# EAGLE schematic final (EAGLE 7.4.0)
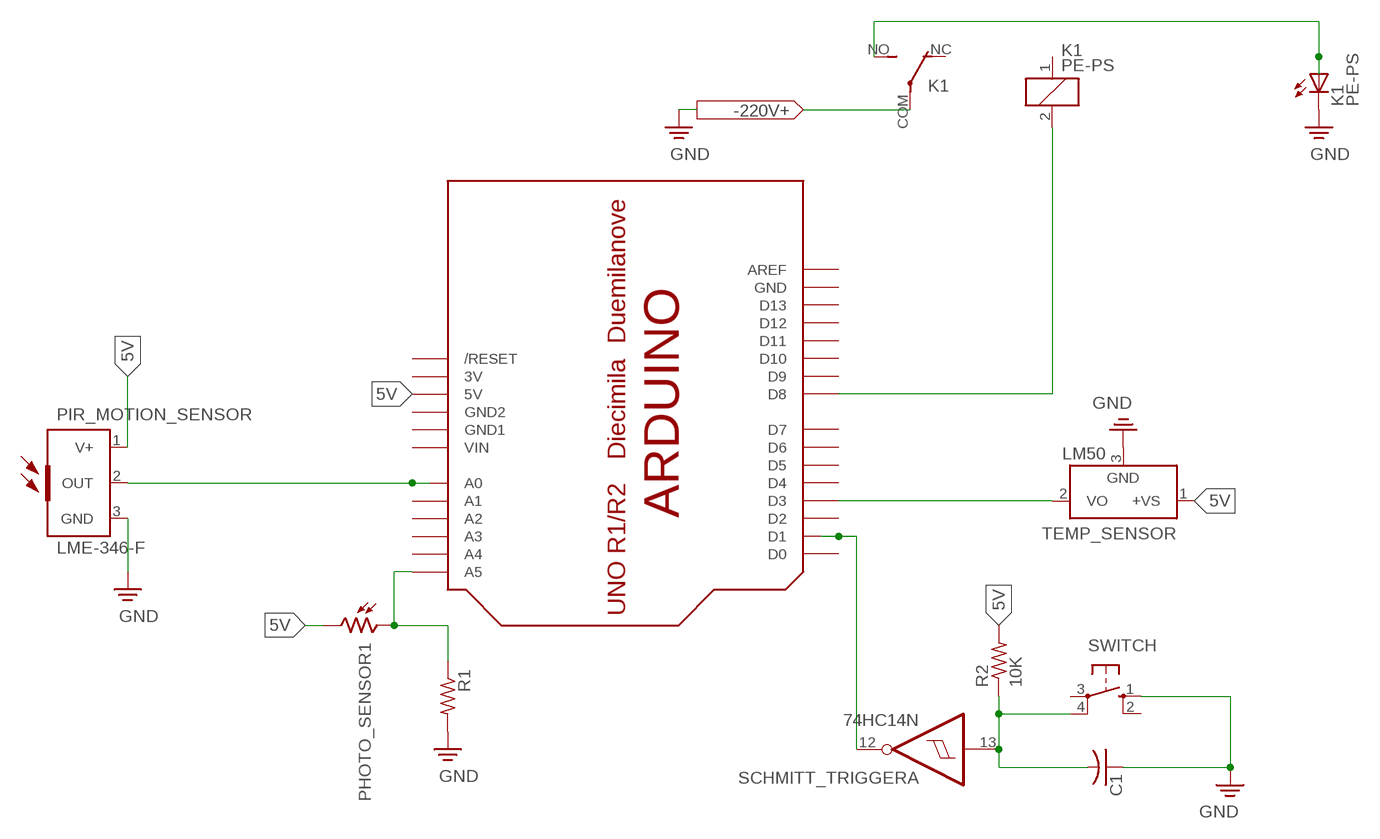
[diagram p0: schematic, sheet 1]

## Parts
C1  C-US025-024X044  [C025-024X044]
K1  PE-PS  [PE-SOCKET]
PHOTO_SENSOR1  PHOTOCELLD11  [D11XX_H]
PIR_MOTION_SENSOR  LME-346-F  [TO39]
R1  R-US_0207/7  [0207/7]
R2  10K  R-US_0207/7  [0207/7]
SCHMITT_TRIGGER  74HC14N  [DIL14]
SWITCH  40-XX  [B3F-40XX]
TEMP_SENSOR  LM50  [SOT23]
U$1  ARDUINOUNO  [ARDUINO]

## Nets
5V: PIR_MOTION_SENSOR.1(V+)
N$1: R2.1 SCHMITT_TRIGGER.13(A:I) SWITCH.4(P1)
N$2: PHOTO_SENSOR1.2
N$3: SCHMITT_TRIGGER.12(A:O) U$1.D1
N$4: PHOTO_SENSOR1.1 R1.1 U$1.A5
N$5: PIR_MOTION_SENSOR.2(OUT) U$1.A0
N$6: TEMP_SENSOR.2(VO) U$1.D3
N$8: K1.+LED(-LED:A) K1.NO(2:S)
N$9: K1.2 U$1.D8
PE: C1.1 K1.-LED(-LED:C) PIR_MOTION_SENSOR.3(GND) R1.2 SWITCH.1(S) TEMP_SENSOR.3(GND) ; supply symbol labelled GND
Unconnected: C1.2 K1.1 K1.COM(2:P) K1.NC(2:O) R2.2 SCHMITT_TRIGGER.1(D:I) SCHMITT_TRIGGER.2(D:O) SCHMITT_TRIGGER.3(E:I) SCHMITT_TRIGGER.4(E:O) SCHMITT_TRIGGER.5(F:I) SCHMITT_TRIGGER.6(F:O) SCHMITT_TRIGGER.8(C:O) SCHMITT_TRIGGER.9(C:I) SCHMITT_TRIGGER.10(B:O) SCHMITT_TRIGGER.11(B:I) SWITCH.2(S1) SWITCH.3(P) TEMP_SENSOR.1(+VS) U$1.A1 U$1.A2 U$1.A3 U$1.A4 U$1.AREF U$1.D0 U$1.D2 U$1.D4 U$1.D5 U$1.D6 U$1.D7 U$1.D9 U$1.D10 U$1.D11 U$1.D12 U$1.D13 U$1.RESET(/RESET)

## Power pins joined to a net without a drawn wire
3V: U$1.3V
5V: U$1.5V
GND: SCHMITT_TRIGGER.7(P:GND) U$1.GND
GND1: U$1.GND1
GND2: U$1.GND2
VCC: SCHMITT_TRIGGER.14(P:VCC)
VIN: U$1.VIN

## Library data of the parts
C1 = adafruit:C-US: CAPACITOR, American symbol
K1 = relay:PE-PS: SLIM POWER Relay SOCKET NAiS Source: http://www.mew-europe.com/.. en_ds_61122_0000.pdf; OC_FARNELL: unknown; OC_NEWARK: unknown
PHOTO_SENSOR1 = photo-elements:PHOTOCELL: Photo Sensor
PIR_MOTION_SENSOR = sensor-infratec:LME-346-F: pyroelectric detector Source: http://www.InfraTec.de .. Datasheet_S85159.pdf; OC_FARNELL: unknown; OC_NEWARK: unknown
R1 R2 = adafruit:R-US_: RESISTOR, American symbol
SCHMITT_TRIGGER = 74xx-eu:74*14: Hex schmitt trigger INVERTER
SWITCH = adafruit:40-XX: OMRON SWITCH; MF: OMRON COMPONENTS USA; MPN: B3F-4000; OC_FARNELL: 176434; OC_NEWARK: 36K3105
TEMP_SENSOR = linear:LM50: SOT-23 Single-Supply Centigrade Temperature Sensor Vout = (10mV/°C x Temp °C) +5mmmV Source: http://cache.national.com/ds/LM/LM50.pdf
U$1 = adafruit:ARDUINO: Arduino Diecimila/Duemilanove Make a shield with ease, this package has all the named pins as well as the two mounting drill holes and an outline of the USB and DC power connector. The outline is on the DIMENSION layer, so if your board house uses it they will cut the outline to match. http://www.ladyada.net/library/pcb/eaglelibrary.html